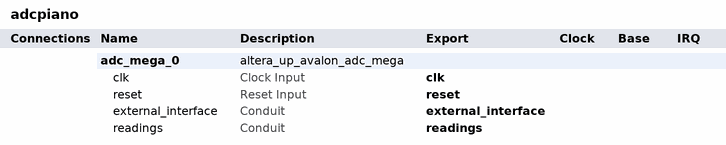
[diagram p0: system contents]
# Platform Designer (Qsys) system adcpiano, Cyclone IV E EP4CE22F17C6
# Parameters at their usual value, and those the tool derives, are not listed.
package require -exact qsys 17.0
create_system adcpiano
set_project_property DEVICE_FAMILY {Cyclone IV E}
set_project_property DEVICE EP4CE22F17C6

add_instance adc_mega_0 altera_up_avalon_adc_mega 17.0
set_instance_property adc_mega_0 AUTO_EXPORT true
set_instance_parameter_value adc_mega_0 board DE0-Nano
set_instance_parameter_value adc_mega_0 numch_ 1
set_instance_parameter_value adc_mega_0 sclk_freq 3.2

# exported interfaces
add_interface clk clock sink
set_interface_property clk EXPORT_OF adc_mega_0.clk
add_interface external_interface conduit end
set_interface_property external_interface EXPORT_OF adc_mega_0.external_interface
add_interface readings conduit end
set_interface_property readings EXPORT_OF adc_mega_0.readings
add_interface reset reset sink
set_interface_property reset EXPORT_OF adc_mega_0.reset

set_interconnect_requirement {$system} qsys_mm.clockCrossingAdapter HANDSHAKE
set_interconnect_requirement {$system} qsys_mm.enableEccProtection FALSE
set_interconnect_requirement {$system} qsys_mm.insertDefaultSlave FALSE
set_interconnect_requirement {$system} qsys_mm.maxAdditionalLatency 1

save_system adcpiano.qsys
